# Altium schematic sheet SoC RGMII.SchDoc
size A3; DocumentNumber: 10; SheetNumber: 11; SheetTotal: 14
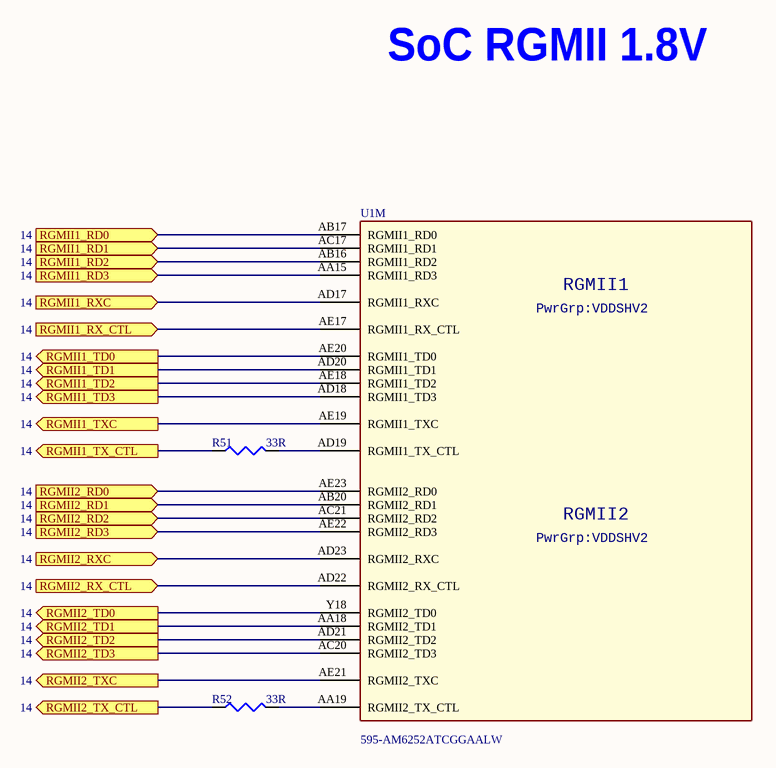
[diagram p0: SoC RGMII.SchDoc]

## Parts
R51  33R  [R0201]
R52  33R  [R0201]
U1  Supplier Part Number 1: 595-AM6252ATCGGAALW  [BGA425C50P25X25_1300X1300X89]  (hidden comment: AM62-EVM_BGA425)  (part M of 18)

## Ports
RGMII1_RD0 (in, see 14), RGMII1_RD1 (in, see 14), RGMII1_RD2 (in, see 14), RGMII1_RD3 (in, see 14), RGMII1_RX_CTL (in, see 14), RGMII1_RXC (in, see 14), RGMII1_TD0 (out, see 14), RGMII1_TD1 (out, see 14), RGMII1_TD2 (out, see 14), RGMII1_TD3 (out, see 14), RGMII1_TX_CTL (out, see 14), RGMII1_TXC (out, see 14), RGMII2_RD0 (in, see 14), RGMII2_RD1 (in, see 14), RGMII2_RD2 (in, see 14), RGMII2_RD3 (in, see 14), RGMII2_RX_CTL (in, see 14), RGMII2_RXC (in, see 14), RGMII2_TD0 (out, see 14), RGMII2_TD1 (out, see 14), RGMII2_TD2 (out, see 14), RGMII2_TD3 (out, see 14), RGMII2_TX_CTL (out, see 14), RGMII2_TXC (out, see 14)

## Nets
RGMII1_RD0: U1.AB17(RGMII1_RD0) ; port RGMII1_RD0
RGMII1_RD1: U1.AC17(RGMII1_RD1) ; port RGMII1_RD1
RGMII1_RD2: U1.AB16(RGMII1_RD2) ; port RGMII1_RD2
RGMII1_RD3: U1.AA15(RGMII1_RD3) ; port RGMII1_RD3
RGMII1_RX_CTL: U1.AE17(RGMII1_RX_CTL) ; port RGMII1_RX_CTL
RGMII1_RXC: U1.AD17(RGMII1_RXC) ; port RGMII1_RXC
RGMII1_TD0: U1.AE20(RGMII1_TD0) ; port RGMII1_TD0
RGMII1_TD1: U1.AD20(RGMII1_TD1) ; port RGMII1_TD1
RGMII1_TD2: U1.AE18(RGMII1_TD2) ; port RGMII1_TD2
RGMII1_TD3: U1.AD18(RGMII1_TD3) ; port RGMII1_TD3
RGMII1_TX_CTL: R51.1 ; port RGMII1_TX_CTL
RGMII1_TXC: U1.AE19(RGMII1_TXC) ; port RGMII1_TXC
RGMII2_RD0: U1.AE23(RGMII2_RD0) ; port RGMII2_RD0
RGMII2_RD1: U1.AB20(RGMII2_RD1) ; port RGMII2_RD1
RGMII2_RD2: U1.AC21(RGMII2_RD2) ; port RGMII2_RD2
RGMII2_RD3: U1.AE22(RGMII2_RD3) ; port RGMII2_RD3
RGMII2_RX_CTL: U1.AD22(RGMII2_RX_CTL) ; port RGMII2_RX_CTL
RGMII2_RXC: U1.AD23(RGMII2_RXC) ; port RGMII2_RXC
RGMII2_TD0: U1.Y18(RGMII2_TD0) ; port RGMII2_TD0
RGMII2_TD1: U1.AA18(RGMII2_TD1) ; port RGMII2_TD1
RGMII2_TD2: U1.AD21(RGMII2_TD2) ; port RGMII2_TD2
RGMII2_TD3: U1.AC20(RGMII2_TD3) ; port RGMII2_TD3
RGMII2_TX_CTL: R52.1 ; port RGMII2_TX_CTL
RGMII2_TXC: U1.AE21(RGMII2_TXC) ; port RGMII2_TXC
NetR51_2: R51.2 U1.AD19(RGMII1_TX_CTL)
NetR52_2: R52.2 U1.AA19(RGMII2_TX_CTL)

## Notes on the sheet
- SoC RGMII 1.8V
- (in symbol AM62-EVM_BGA425, part M) RGMII1; PwrGrp:VDDSHV2; RGMII2

## Library data of the parts
R51 R52 = RC0201FR-0733RL: RES 33 OHM 1% 1/20W 0201; Manufacturer: Yageo; Power Rating: 50mW; Voltage Rating: 25V; Temperature Coefficient: 200ppm/°C; Supplier 1: Digi-Key; Manufacturer Part Number: RC0201FR-0733RL; Stock 1: 4610000; Pricing 1: 10000=0.0053, 50000=0.0042, 100000=0.0038 (USD); Case/Package: 0201; Case Code (Metric): 0603; Case Code (Imperial): 0201; Size Code: 0201; Min Operating Temperature: -55°C; Max Operating Temperature: 125°C; Resistance: 33R; Tolerance: 1%; Package Quantity: 1; Packaging: Cut Tape; Resistor Type: Thick Film; Number of Terminations: 2; Termination: SMD/SMT; Max Power Dissipation: 50mW; Features: Moisture Resistant; Series: RC; Resistance Tolerance: 1%; Length: 0.024inch; Width: 0.012inch; Height: 0.01inch; Lead Free: Lead Free; RoHS Compliant: Yes; ComponentLink1URL: https://datasheet.ciiva.com/7672/1563626-7672223.pdf?src-supplier=Element14; ComponentLink1Description: https://datasheet.ciiva.com/7672/1563626-7672223.pdf?src-supplier=Element14; ComponentLink2URL: https://datasheet.ciiva.com/22698/1563626-22698520.pdf?src-supplier=Element14; ComponentLink2Description: https://datasheet.ciiva.com/22698/1563626-22698520.pdf?src-supplier=Element14; ComponentLink3URL: https://datasheet.ciiva.com/2560/pyu-r-int-thick-7-2560878.pdf?src-supplier=Digi-Key; ComponentLink3Description: https://datasheet.ciiva.com/2560/pyu-r-int-thick-7-2560878.pdf?src-supplier=Digi-Key; ComponentLink4URL: https://datasheet.ciiva.com/2560/pyu-r-int-thick-7-2560879.pdf?src-supplier=Digi-Key; ComponentLink4Description: https://datasheet.ciiva.com/2560/pyu-r-int-thick-7-2560879.pdf?src-supplier=Digi-Key; ComponentLink5URL: https://datasheet.ciiva.com/2560/pyu-r-int-thick-7-2560877.pdf?src-supplier=Digi-Key; ComponentLink5Description: https://datasheet.ciiva.com/2560/pyu-r-int-thick-7-2560877.pdf?src-supplier=Digi-Key; Supplier Part Number 1: 311-33.0MTR-ND
U1 = AM62-EVM_BGA425: ARM® Cortex®-A53 Microprocessor IC Sitara™ 2 Core, 64-Bit 1.4GHz 425-FCCSP (13x13); Manufacturer: Texas Instruments; Manufacturer Part Number: AM6252ATCGGAALW; Supplier 1: Mouser; Stock 1: 0; Pricing 1: 1=21.23, 10=19.58, 50=18.7, 100=18.7, 1000=15.94, 10000=15.94 (USD)